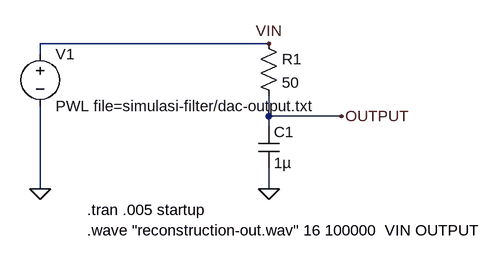
[diagram p0: schematic reconstruction-filter.asc]
reconstruction-filter.asc, the LTspice schematic file:
Version 4
SHEET 1 880 680
WIRE 80 64 -272 64
WIRE -272 80 -272 64
WIRE 80 176 80 144
WIRE 192 176 80 176
WIRE 80 192 80 176
WIRE -272 288 -272 160
WIRE 80 288 80 256
FLAG 192 176 OUTPUT
FLAG 80 288 0
FLAG -272 288 0
FLAG 80 64 VIN
SYMBOL res 64 48 R0
SYMATTR InstName R1
SYMATTR Value 50
SYMATTR SpiceLine tol=1 pwr=0.1
SYMBOL cap 64 192 R0
SYMATTR InstName C1
SYMATTR Value 1µ
SYMATTR SpiceLine V=4 Irms=0 Rser=0 Lser=0 mfg="Murata" pn="GRM152R60G105ME15" type="X5R"
SYMBOL voltage -272 64 R0
WINDOW 123 0 0 Left 0
WINDOW 39 0 0 Left 0
SYMATTR InstName V1
SYMATTR Value PWL file=simulasi-filter/dac-output.txt
TEXT -200 320 Left 2 !.tran .005 startup
TEXT -200 352 Left 2 !.wave "reconstruction-out.wav" 16 100000  VIN OUTPUT

The netlist it stands for:
* reconstruction-filter.asc
R1 VIN OUTPUT 50 tol=1 pwr=0.1
C1 OUTPUT 0 1µ V=4 Irms=0 Rser=0 Lser=0 mfg="Murata" pn="GRM152R60G105ME15" type="X5R"
V1 VIN 0 PWL file=simulasi-filter/dac-output.txt
.tran .005 startup
.wave "reconstruction-out.wav" 16 100000  VIN OUTPUT
.backanno
.end

* Results of the author's LTspice run, read from the files saved beside the schematic
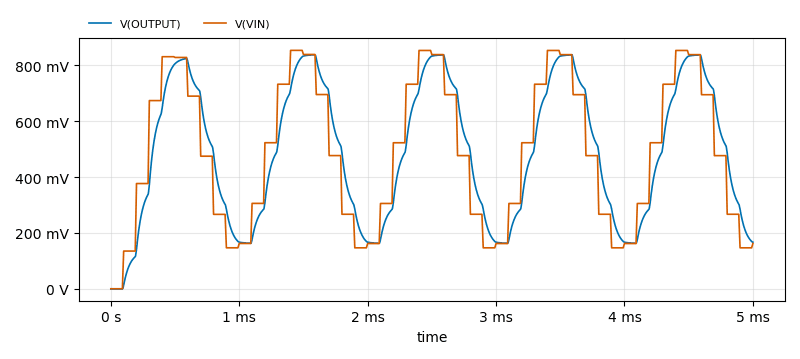
[diagram p1: Transient Analysis of reconstruction-filter.asc, plotted from the saved traces]
* Transient Analysis, 1 run:
*   V(OUTPUT): min 0 V, max 838.3 mV, average 487.2 mV, rms 548.3 mV, last 166.9 mV
*   V(VIN): min 0 V, max 854 mV, average 488.9 mV, rms 555.6 mV, last 162.2 mV